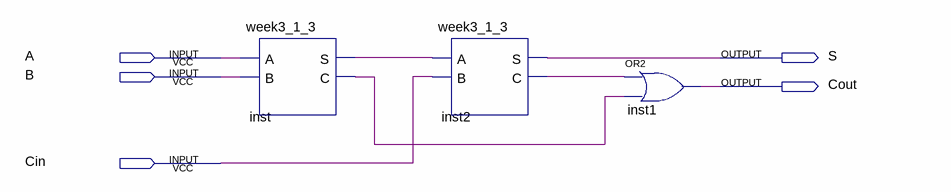
[diagram p0: schematic sheet]
// Quartus schematic week3_1_4.bdf as structural Verilog: 3 symbols, 5 pins
module week3_1_4 (
  input  A,
  input  B,
  input  Cin,
  output S,
  output Cout
);

  wire inst2_c, inst_c, inst_s;

  week3_1_3 inst (.A(A), .B(B), .S(inst_s), .C(inst_c));
  week3_1_3 inst2 (.A(inst_s), .B(Cin), .S(S), .C(inst2_c));
  or inst1 (Cout, inst2_c, inst_c);
endmodule
